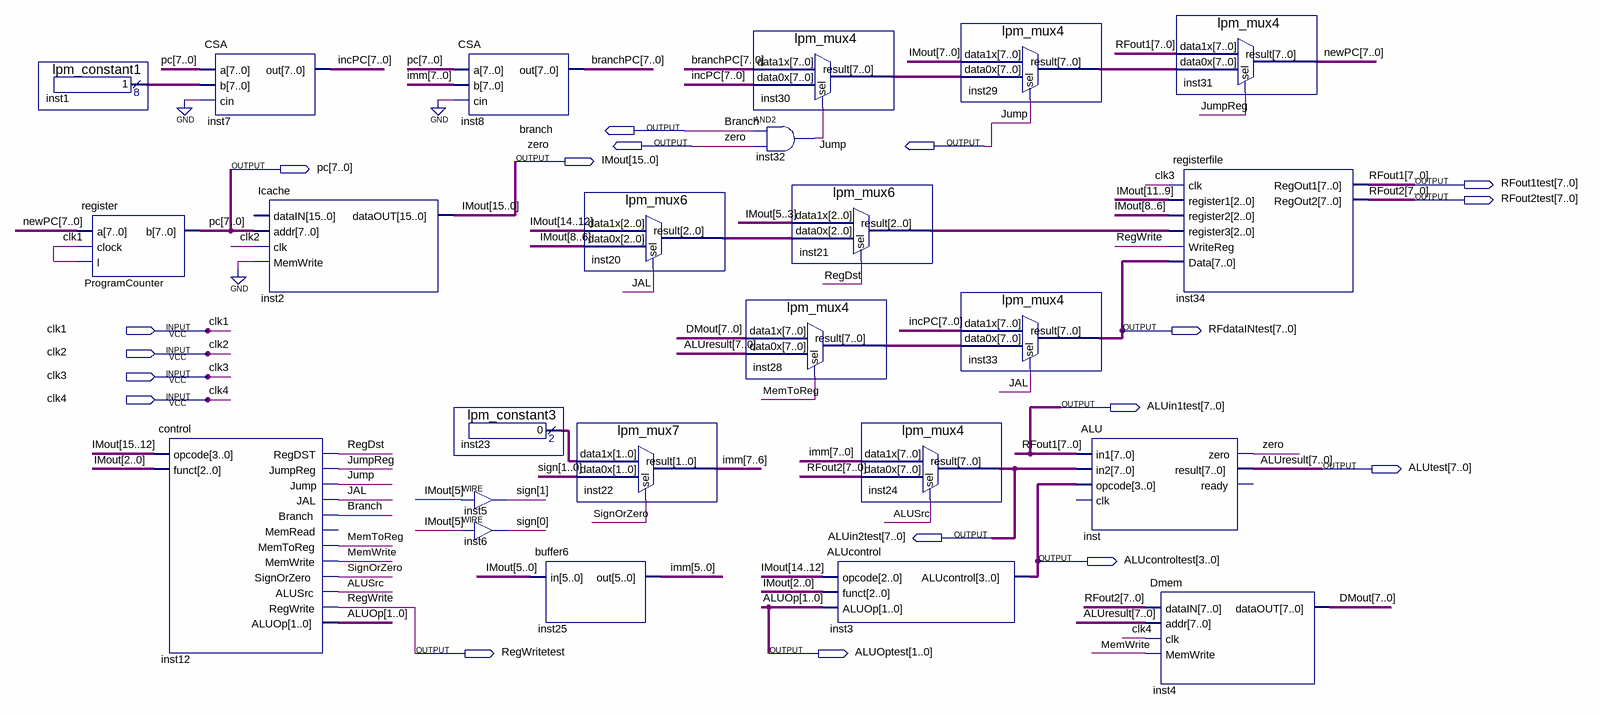
[diagram p0: schematic sheet]
// Quartus schematic SingleCycleDebug.bdf as structural Verilog: 24 symbols, 18 pins
module SingleCycleDebug (
  input  clk1,
  input  clk2,
  input  clk3,
  input  clk4,
  output branch,
  output zero,
  output Jump,
  output [15:0] IMout,
  output [7:0] pc,
  output [7:0] RFout1test,
  output [7:0] RFout2test,
  output [7:0] RFdataINtest,
  output [7:0] ALUin1test,
  output [7:0] ALUtest,
  output [7:0] ALUin2test,
  output [3:0] ALUcontroltest,
  output RegWritetest,
  output [1:0] ALUOptest
);

  wire ALUSrc, inst32_out, JAL, JumpReg, MemToReg, MemWrite, RegDst, SignOrZero;
  wire [1:0] inst23_result, sign;
  wire [2:0] inst20_result, inst21_result;
  wire [7:0] branchPC, DMout, imm, incPC, inst1_result, inst28_result, inst29_result, inst30_result, newPC;

  lpm_constant1 inst1 (.result(inst1_result));
  register ProgramCounter (.a(newPC), .clock(clk1), .l(clk1), .b(pc));
  control inst12 (
    .opcode(IMout[15:12]), .funct(IMout[2:0]), .RegDST(RegDst), .JumpReg(JumpReg), .Jump(Jump), .JAL(JAL),
    .Branch(branch), .MemToReg(MemToReg), .MemWrite(MemWrite), .SignOrZero(SignOrZero), .ALUSrc(ALUSrc),
    .RegWrite(RegWritetest), .ALUOp(ALUOptest));  // open: MemRead
  CSA inst7 (.a(pc), .b(inst1_result), .cin(1'b0), .out(incPC));
  Icache inst2 (.addr(pc), .clk(clk2), .MemWrite(1'b0), .dataOUT(IMout));  // open: dataIN
  CSA inst8 (.a(pc), .b(imm), .cin(1'b0), .out(branchPC));
  lpm_constant3 inst23 (.result(inst23_result));
  assign sign[1] = IMout[5];  // WIRE inst5
  assign sign[0] = IMout[5];  // WIRE inst6
  buffer6 inst25 (.in(IMout[5:0]), .out(imm[5:0]));
  lpm_mux6 inst20 (.data1x(IMout[14:12]), .data0x(IMout[8:6]), .sel(JAL), .result(inst20_result));
  lpm_mux7 inst22 (.data1x(inst23_result), .data0x(sign), .sel(SignOrZero), .result(imm[7:6]));
  lpm_mux4 inst30 (.data1x(branchPC), .data0x(incPC), .sel(inst32_out), .result(inst30_result));
  and inst32 (inst32_out, branch, zero);
  lpm_mux4 inst28 (.data1x(DMout), .data0x(ALUtest), .sel(MemToReg), .result(inst28_result));
  lpm_mux6 inst21 (.data1x(IMout[5:3]), .data0x(inst20_result), .sel(RegDst), .result(inst21_result));
  ALUcontrol inst3 (.opcode(IMout[14:12]), .funct(IMout[2:0]), .ALUOp(ALUOptest), .ALUcontrol(ALUcontroltest));
  lpm_mux4 inst24 (.data1x(imm), .data0x(RFout2test), .sel(ALUSrc), .result(ALUin2test));
  lpm_mux4 inst29 (.data1x(IMout[7:0]), .data0x(inst30_result), .sel(Jump), .result(inst29_result));
  lpm_mux4 inst33 (.data1x(incPC), .data0x(inst28_result), .sel(JAL), .result(RFdataINtest));
  ALU inst (
    .in1(ALUin1test), .in2(ALUin2test), .opcode(ALUcontroltest), .zero(zero), .result(ALUtest));  // open: clk, ready
  Dmem inst4 (.dataIN(RFout2test), .addr(ALUtest), .clk(clk4), .MemWrite(MemWrite), .dataOUT(DMout));
  lpm_mux4 inst31 (.data1x(ALUin1test), .data0x(inst29_result), .sel(JumpReg), .result(newPC));
  registerfile inst34 (
    .clk(clk3), .register1(IMout[11:9]), .register2(IMout[8:6]), .register3(inst21_result),
    .WriteReg(RegWritetest), .Data(RFdataINtest), .RegOut1(ALUin1test), .RegOut2(RFout2test));

  assign RFout1test = ALUin1test;

  // Other names for the same wires on the sheet: RFout1[7:0] = ALUin1test; ALUOp[1:0] = ALUOptest;
  //   ALUresult[7:0] = ALUtest; RegWrite = RegWritetest; RFout2[7:0] = RFout2test
endmodule
